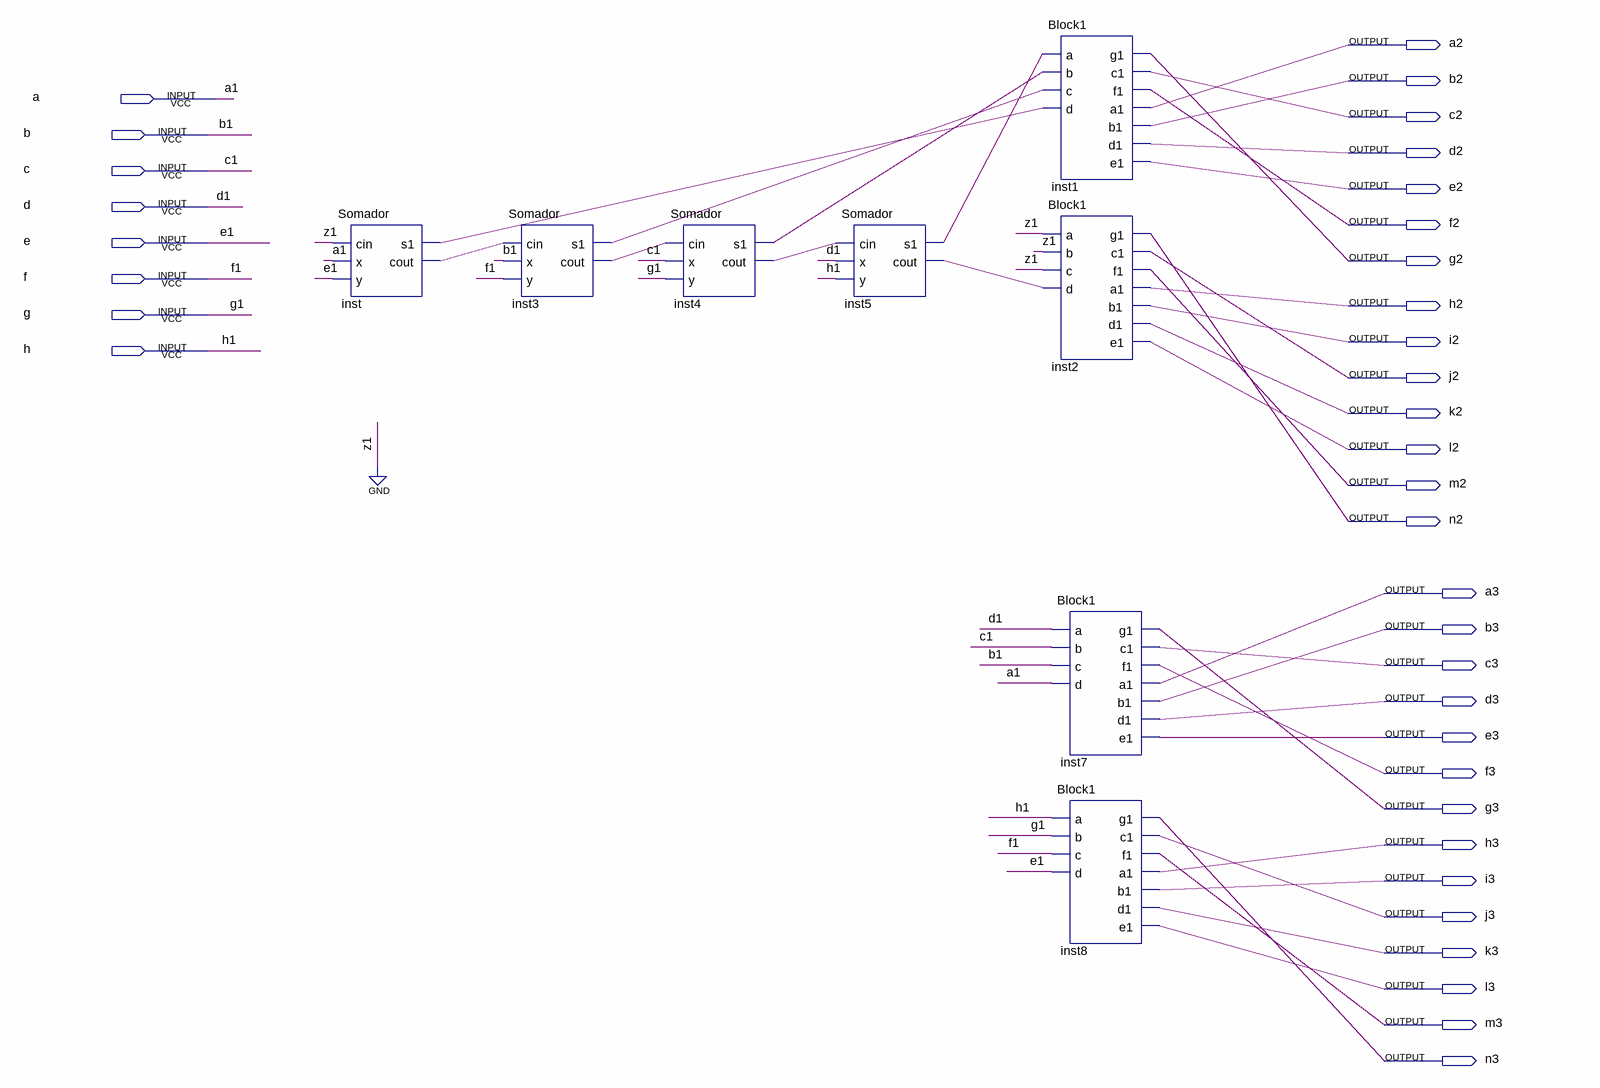
[diagram p0: schematic sheet]
// Quartus schematic aula06.bdf as structural Verilog: 8 symbols, 36 pins
module aula06 (
  input  a,
  input  b,
  input  c,
  input  d,
  input  e,
  input  f,
  input  g,
  input  h,
  output a2,
  output b2,
  output c2,
  output d2,
  output e2,
  output f2,
  output g2,
  output h2,
  output i2,
  output j2,
  output k2,
  output l2,
  output m2,
  output n2,
  output a3,
  output b3,
  output c3,
  output d3,
  output e3,
  output f3,
  output g3,
  output h3,
  output i3,
  output j3,
  output k3,
  output l3,
  output m3,
  output n3
);

  wire inst3_cout, inst3_s1, inst4_cout, inst4_s1, inst5_cout, inst5_s1, inst_cout, inst_s1;

  Somador inst (.cin(1'b0), .x(a), .y(e), .s1(inst_s1), .cout(inst_cout));
  Somador inst3 (.cin(inst_cout), .x(b), .y(f), .s1(inst3_s1), .cout(inst3_cout));
  Somador inst4 (.cin(inst3_cout), .x(c), .y(g), .s1(inst4_s1), .cout(inst4_cout));
  Somador inst5 (.cin(inst4_cout), .x(d), .y(h), .s1(inst5_s1), .cout(inst5_cout));
  Block1 inst1 (
    .a(inst5_s1), .b(inst4_s1), .c(inst3_s1), .d(inst_s1), .g1(g2), .c1(c2), .f1(f2), .a1(a2), .b1(b2),
    .d1(d2), .e1(e2));
  Block1 inst2 (
    .a(1'b0), .b(1'b0), .c(1'b0), .d(inst5_cout), .g1(n2), .c1(j2), .f1(m2), .a1(h2), .b1(i2), .d1(k2),
    .e1(l2));
  Block1 inst7 (.a(d), .b(c), .c(b), .d(a), .g1(g3), .c1(c3), .f1(f3), .a1(a3), .b1(b3), .d1(d3), .e1(e3));
  Block1 inst8 (.a(h), .b(g), .c(f), .d(e), .g1(n3), .c1(j3), .f1(m3), .a1(h3), .b1(i3), .d1(k3), .e1(l3));

  // Other names for the same wires on the sheet: a1 = a; b1 = b; c1 = c; d1 = d; e1 = e; f1 = f; g1 = g; h1 = h
endmodule
